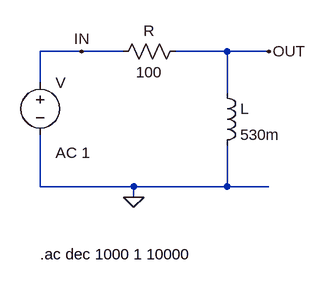
[diagram p0: schematic test_bode.asc]
test_bode.asc, the LTspice schematic file:
Version 4
SHEET 1 880 680
WIRE -32 128 -96 128
WIRE 32 128 -32 128
WIRE 192 128 112 128
WIRE 256 128 192 128
WIRE -96 176 -96 128
WIRE 192 192 192 128
WIRE -96 336 -96 256
WIRE 48 336 -96 336
WIRE 192 336 192 272
WIRE 192 336 48 336
WIRE 256 336 192 336
WIRE 48 352 48 336
FLAG 48 352 0
FLAG -32 128 IN
FLAG 256 128 OUT
SYMBOL res 128 112 R90
WINDOW 0 0 56 VBottom 2
WINDOW 3 32 56 VTop 2
SYMATTR InstName R
SYMATTR Value 100
SYMBOL ind 176 176 R0
SYMATTR InstName L
SYMATTR Value 530m
SYMBOL voltage -96 160 R0
WINDOW 123 24 124 Left 2
WINDOW 39 0 0 Left 0
SYMATTR Value2 AC 1
SYMATTR InstName V
SYMATTR Value ""
TEXT -96 440 Left 2 !.ac dec 1000 1 10000

The netlist it stands for:
* test_bode.asc
R OUT IN 100
L OUT 0 530m
V IN 0 AC 1
.ac dec 1000 1 10000
.backanno
.end